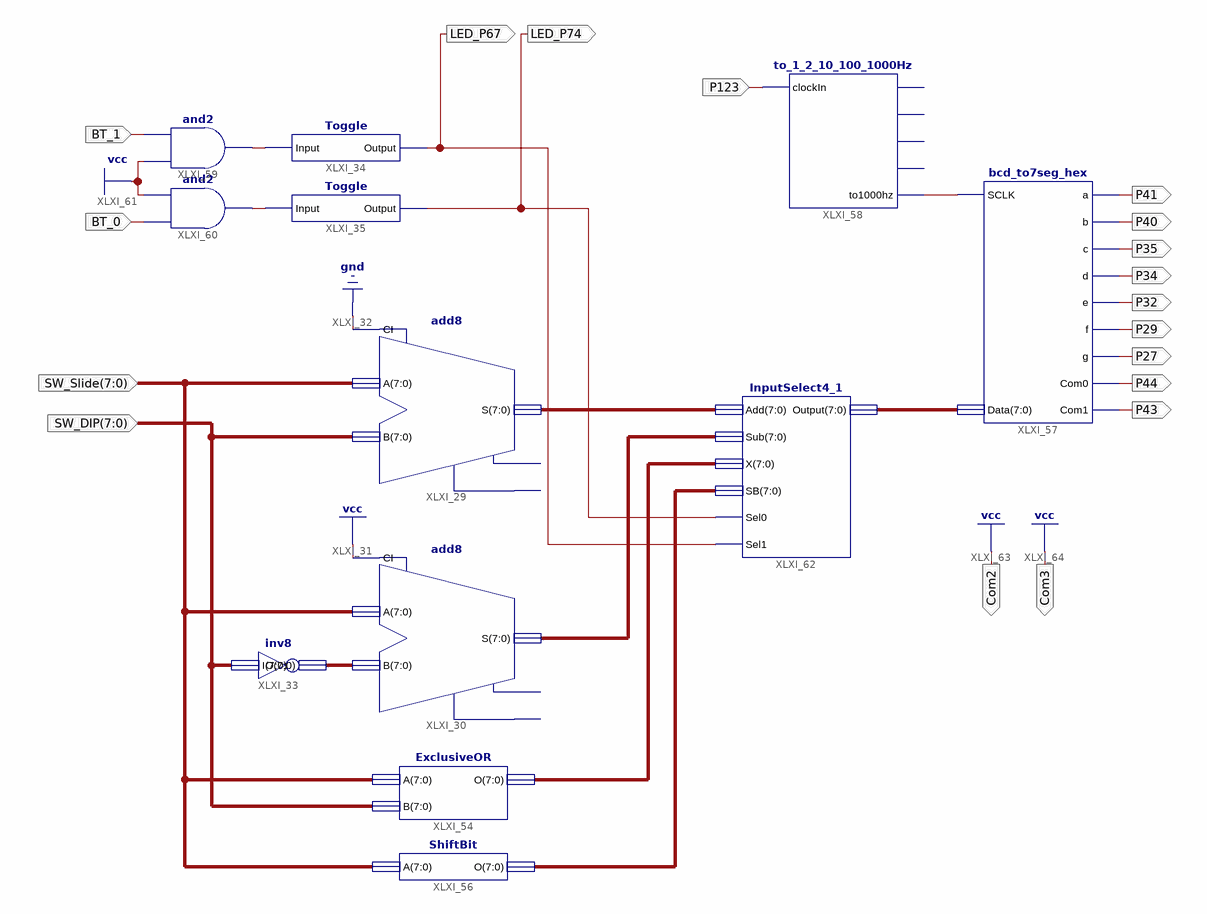
[diagram p0: schematic sheet 1]
// Xilinx ISE schematic testFPGA.sch (spartan6) as structural Verilog: 12 symbols, 18 ports
module testFPGA (
  input  [7:0] SW_Slide,
  input  [7:0] SW_DIP,
  input  P123,
  input  BT_1,
  input  BT_0,
  output LED_P67,
  output LED_P74,
  output P41,
  output P40,
  output P35,
  output P34,
  output P32,
  output P29,
  output P27,
  output P44,
  output P43,
  output Com2,
  output Com3
);

  wire XLXN_166, XLXN_180, XLXN_181;
  wire [7:0] XLXN_98, XLXN_116, XLXN_117, XLXN_127, XLXN_132, XLXN_164;

  Toggle XLXI_35 (.Input(XLXN_180), .Output(LED_P74));
  Toggle XLXI_34 (.Input(XLXN_181), .Output(LED_P67));
  add8 XLXI_29 (.A(SW_Slide), .B(SW_DIP), .CI(1'b0), .S(XLXN_116));  // open: CO, OFL
  add8 XLXI_30 (.A(SW_Slide), .B(XLXN_98), .CI(1'b1), .S(XLXN_117));  // open: CO, OFL
  inv8 XLXI_33 (.I(SW_DIP), .O(XLXN_98));
  ExclusiveOR XLXI_54 (.A(SW_Slide), .B(SW_DIP), .O(XLXN_127));
  ShiftBit XLXI_56 (.A(SW_Slide), .O(XLXN_132));
  bcd_to7seg_hex XLXI_57 (
    .SCLK(XLXN_166), .Data(XLXN_164), .a(P41), .b(P40), .c(P35), .d(P34), .e(P32), .f(P29), .g(P27),
    .Com0(P44), .Com1(P43));
  to_1_2_10_100_1000Hz XLXI_58 (.clockIn(P123), .to1000hz(XLXN_166));  // open: to1hz, to2hz, to10hz, to100hz
  and XLXI_59 (XLXN_181, 1'b1, BT_1);
  and XLXI_60 (XLXN_180, BT_0, 1'b1);
  InputSelect4_1 XLXI_62 (
    .Add(XLXN_116), .Sub(XLXN_117), .X(XLXN_127), .SB(XLXN_132), .Sel0(LED_P74), .Sel1(LED_P67),
    .Output(XLXN_164));

  assign Com2 = 1'b1;
  assign Com3 = 1'b1;
endmodule
